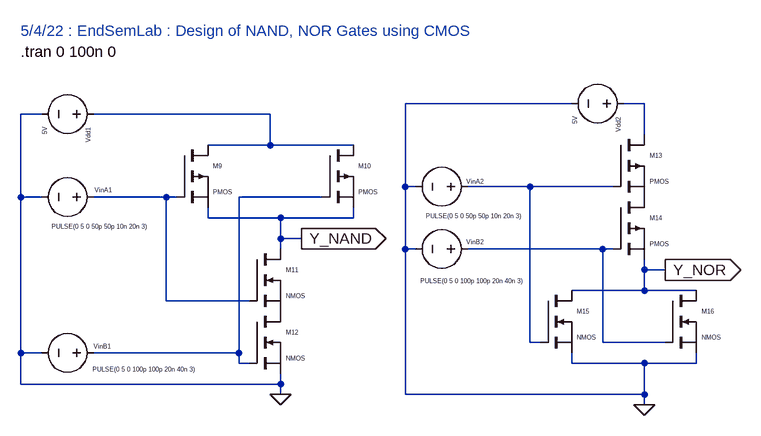
[diagram p0: schematic EndSemLab_NAND_NOR.asc]
EndSemLab_NAND_NOR.asc, the LTspice schematic file:
Version 4
SHEET 1 1084 1268
WIRE 656 48 400 48
WIRE 768 48 736 48
WIRE -160 64 -192 64
WIRE 192 64 -80 64
WIRE 768 96 768 48
WIRE 192 112 192 64
WIRE 192 112 96 112
WIRE 320 112 192 112
WIRE 400 176 400 48
WIRE 416 176 400 176
WIRE 592 176 496 176
WIRE 720 176 592 176
WIRE -192 192 -192 64
WIRE -160 192 -192 192
WIRE 32 192 -80 192
WIRE 48 192 32 192
WIRE 272 192 144 192
WIRE 96 224 96 208
WIRE 208 224 96 224
WIRE 320 224 320 208
WIRE 320 224 208 224
WIRE 208 256 208 224
WIRE 240 256 208 256
WIRE 208 272 208 256
WIRE 400 272 400 176
WIRE 416 272 400 272
WIRE 704 272 496 272
WIRE 720 272 704 272
WIRE 768 304 768 288
WIRE 800 304 768 304
WIRE 768 336 768 304
WIRE 768 336 656 336
WIRE 848 336 768 336
WIRE 32 352 32 192
WIRE 160 352 32 352
WIRE 592 416 592 176
WIRE 608 416 592 416
WIRE 704 416 704 272
WIRE 800 416 704 416
WIRE -192 432 -192 192
WIRE -160 432 -192 432
WIRE 144 432 144 192
WIRE 144 432 -80 432
WIRE 144 448 144 432
WIRE 160 448 144 448
WIRE 656 448 656 432
WIRE 768 448 656 448
WIRE 848 448 848 432
WIRE 848 448 768 448
WIRE -192 480 -192 432
WIRE 208 480 208 464
WIRE 208 480 -192 480
WIRE 208 496 208 480
WIRE 400 496 400 272
WIRE 768 496 768 448
WIRE 768 496 400 496
WIRE 768 512 768 496
FLAG 208 496 0
FLAG 768 512 0
FLAG 240 256 Y_NAND
IOPIN 240 256 Out
FLAG 800 304 Y_NOR
IOPIN 800 304 Out
SYMBOL voltage -64 64 R90
WINDOW 0 21 24 Left 0
WINDOW 3 20 91 Left 0
WINDOW 123 0 0 Left 0
WINDOW 39 0 0 Left 0
SYMATTR InstName Vdd1
SYMATTR Value 5V
SYMBOL pmos 48 112 R0
WINDOW 0 56 32 Left 0
WINDOW 3 56 72 Left 0
SYMATTR InstName M9
SYMBOL pmos 272 112 R0
WINDOW 0 56 32 Left 0
WINDOW 3 56 72 Left 0
SYMATTR InstName M10
SYMBOL nmos 160 272 R0
WINDOW 0 56 32 Left 0
WINDOW 3 56 72 Left 0
SYMATTR InstName M11
SYMBOL nmos 160 368 R0
WINDOW 0 56 32 Left 0
WINDOW 3 56 72 Left 0
SYMATTR InstName M12
SYMBOL voltage -64 192 R90
WINDOW 0 -11 -12 VRight 0
WINDOW 3 45 -69 VRight 0
WINDOW 123 0 0 Left 0
WINDOW 39 0 0 Left 0
SYMATTR InstName VinA1
SYMATTR Value PULSE(0 5 0 50p 50p 10n 20n 3)
SYMBOL voltage -64 432 R90
WINDOW 0 -10 -11 VRight 0
WINDOW 3 25 -143 VRight 0
WINDOW 123 0 0 Left 0
WINDOW 39 0 0 Left 0
SYMATTR InstName VinB1
SYMATTR Value PULSE(0 5 0 100p 100p 20n 40n 3)
SYMBOL voltage 752 48 R90
WINDOW 0 21 24 Left 0
WINDOW 3 20 91 Left 0
WINDOW 123 0 0 Left 0
WINDOW 39 0 0 Left 0
SYMATTR InstName Vdd2
SYMATTR Value 5V
SYMBOL pmos 720 96 R0
WINDOW 0 56 32 Left 0
WINDOW 3 56 72 Left 0
SYMATTR InstName M13
SYMBOL pmos 720 192 R0
WINDOW 0 56 32 Left 0
WINDOW 3 56 72 Left 0
SYMATTR InstName M14
SYMBOL nmos 608 336 R0
WINDOW 0 56 32 Left 0
WINDOW 3 56 72 Left 0
SYMATTR InstName M15
SYMBOL nmos 800 336 R0
WINDOW 0 56 32 Left 0
WINDOW 3 56 72 Left 0
SYMATTR InstName M16
SYMBOL voltage 512 176 R90
WINDOW 0 -8 -9 VRight 0
WINDOW 3 45 -69 VRight 0
WINDOW 123 0 0 Left 0
WINDOW 39 0 0 Left 0
SYMATTR InstName VinA2
SYMATTR Value PULSE(0 5 0 50p 50p 10n 20n 3)
SYMBOL voltage 512 272 R90
WINDOW 0 -11 -9 VRight 0
WINDOW 3 49 -72 VRight 0
WINDOW 123 0 0 Left 0
WINDOW 39 0 0 Left 0
SYMATTR InstName VinB2
SYMATTR Value PULSE(0 5 0 100p 100p 20n 40n 3)
TEXT -192 -64 Left 2 ;5/4/22 : EndSemLab : Design of NAND, NOR Gates using CMOS
TEXT -192 -32 Left 2 !.tran 0 100n 0

The netlist it stands for:
* EndSemLab_NAND_NOR.asc
Vdd1 N002 0 5V
M9 N002 N004 Y_NAND Y_NAND PMOS
M10 N002 N005 Y_NAND Y_NAND PMOS
M11 Y_NAND N004 P001 P001 NMOS
M12 P001 N005 0 0 NMOS
VinA1 N004 0 PULSE(0 5 0 50p 50p 10n 20n 3)
VinB1 N005 0 PULSE(0 5 0 100p 100p 20n 40n 3)
Vdd2 N001 0 5V
M13 N001 N003 P002 P002 PMOS
M14 P002 N006 Y_NOR Y_NOR PMOS
M15 Y_NOR N003 0 0 NMOS
M16 Y_NOR N006 0 0 NMOS
VinA2 N003 0 PULSE(0 5 0 50p 50p 10n 20n 3)
VinB2 N006 0 PULSE(0 5 0 100p 100p 20n 40n 3)
.model NMOS NMOS
.model PMOS PMOS
.lib standard.mos
* 5/4/22 : EndSemLab : Design of NAND, NOR Gates using CMOS
.tran 0 100n 0
.backanno
.end